# Altium schematic sheet Relays.SchDoc
size A4
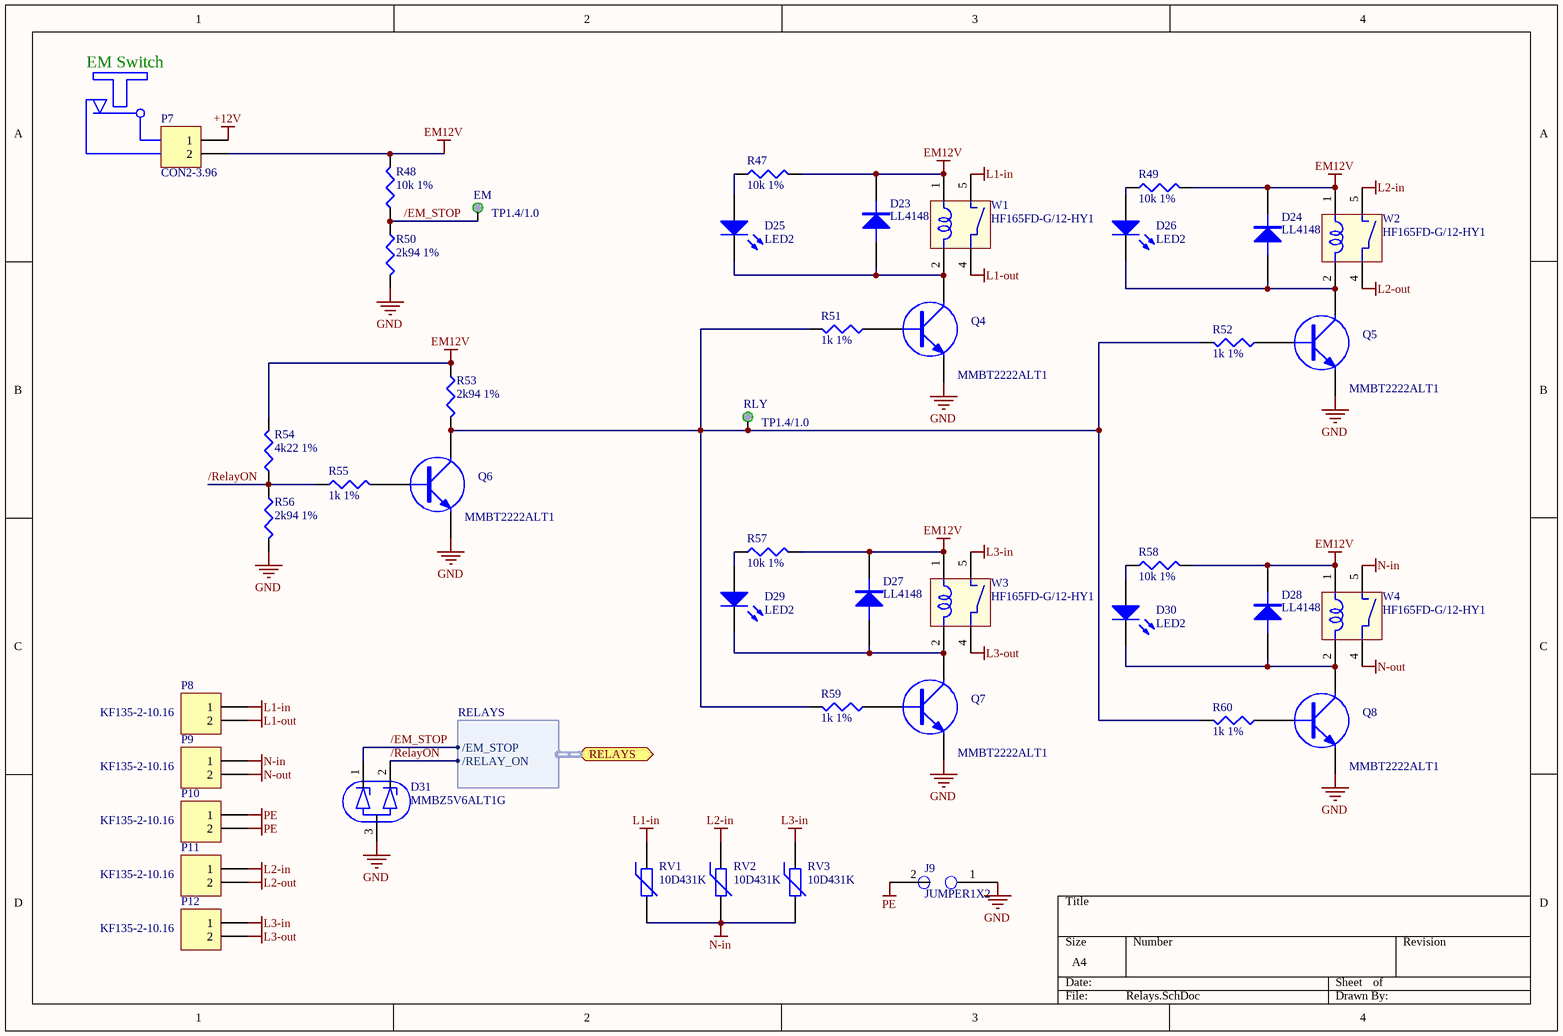
[diagram p0: Relays.SchDoc]

## Parts
D23  LL4148  [MELF-D3513-1405]
D24  LL4148  [MELF-D3513-1405]
D25  LED2  [3.2X1.6X1.1]
D26  LED2  [3.2X1.6X1.1]
D27  LL4148  [MELF-D3513-1405]
D28  LL4148  [MELF-D3513-1405]
D29  LED2  [3.2X1.6X1.1]
D30  LED2  [3.2X1.6X1.1]
D31  MMBZ5V6ALT1G  [SOT23-3N]
EM  TP1.4/1.0  [TP1.4/1.0]  (no BOM)
J9  JUMPER1X2  [JP-SOLDER-H1X2-3X2]  (no BOM)
P7  CON2-3.96  [CON2/3.96mm]
P8  KF135-2-10.16  [KF135-2-10.16]
P9  KF135-2-10.16  [KF135-2-10.16]
P10  KF135-2-10.16  [KF135-2-10.16]
P11  KF135-2-10.16  [KF135-2-10.16]
P12  KF135-2-10.16  [KF135-2-10.16]
Q4  MMBT2222ALT1  [SOT23-3N]
Q5  MMBT2222ALT1  [SOT23-3N]
Q6  MMBT2222ALT1  [SOT23-3N]
Q7  MMBT2222ALT1  [SOT23-3N]
Q8  MMBT2222ALT1  [SOT23-3N]
R47  10k 1%  [RESC2012N]
R48  10k 1%  [RESC2012N]
R49  10k 1%  [RESC2012N]
R50  2k94 1%  [RESC2012N]
R51  1k 1%  [RESC2012N]
R52  1k 1%  [RESC2012N]
R53  2k94 1%  [RESC2012N]
R54  4k22 1%  [RESC2012N]
R55  1k 1%  [RESC2012N]
R56  2k94 1%  [RESC2012N]
R57  10k 1%  [RESC2012N]
R58  10k 1%  [RESC2012N]
R59  1k 1%  [RESC2012N]
R60  1k 1%  [RESC2012N]
RLY  TP1.4/1.0  [TP1.4/1.0]  (no BOM)
RV1  10D431K  [10D431K]
RV2  10D431K  [10D431K]
RV3  10D431K  [10D431K]
W1  HF165FD-G/12-HY1  [HF165FD-G/12-HY1]
W2  HF165FD-G/12-HY1  [HF165FD-G/12-HY1]
W3  HF165FD-G/12-HY1  [HF165FD-G/12-HY1]
W4  HF165FD-G/12-HY1  [HF165FD-G/12-HY1]

## Ports
RELAYS (harness RELAYS)

## Harnesses
RELAYS: /EM_STOP, /RELAY_ON

## Nets
+12V: P7.1
EM12V: D23.2(K) D24.2(K) D27.2(K) D28.2(K) P7.2 R47.2 R48.2 R49.2 R53.1 R54.2 R57.2 R58.2 W1.1 W2.1 W3.1 W4.1
GND: D31.3 J9.1 Q4.2(E) Q5.2(E) Q6.2(E) Q7.2(E) Q8.2(E) R50.2 R56.2
L1-in: P8.1 RV1.1 W1.5
L1-out: P8.2 W1.4
L2-in: P11.1 RV2.1 W2.5
L2-out: P11.2 W2.4
L3-in: P12.1 RV3.1 W3.5
L3-out: P12.2 W3.4
N-in: P9.1 RV1.2 RV2.2 RV3.2 W4.5
N-out: P9.2 W4.4
PE: J9.2 P10.1 P10.2
/EM_STOP: D31.1 EM.1 R48.1 R50.1 ; port RELAYS./EM_STOP
/RelayON: D31.2 R54.1 R55.1 R56.1 ; port RELAYS./RELAY_ON
NetD23_1: D23.1(A) D25.2(K) Q4.3(C) W1.2
NetD24_1: D24.1(A) D26.2(K) Q5.3(C) W2.2
NetD25_1: D25.1(A) R47.1
NetD26_1: D26.1(A) R49.1
NetD27_1: D27.1(A) D29.2(K) Q7.3(C) W3.2
NetD28_1: D28.1(A) D30.2(K) Q8.3(C) W4.2
NetD29_1: D29.1(A) R57.1
NetD30_1: D30.1(A) R58.1
NetQ4_1: Q4.1(B) R51.1
NetQ5_1: Q5.1(B) R52.1
NetQ6_1: Q6.1(B) R55.2
NetQ6_3: Q6.3(C) R51.2 R52.2 R53.2 R59.2 R60.2 RLY.1
NetQ7_1: Q7.1(B) R59.1
NetQ8_1: Q8.1(B) R60.1

## Notes on the sheet
- EM Switch

## Library data of the parts
D23 D24 D27 D28 = DIODE
D25 D26 D29 D30 = LED2: Typical RED, GREEN, YELLOW, AMBER GaAs LED; Published: 8-Jun-2000; LatestRevisionDate: 17-Jul-2002; LatestRevisionNote: Re-released for DXP Platform.; PackageDocument: Feb-2002; PackageReference: 3.2X1.6X1.1; Publisher: Altium Limited
D31 = PESD3V3S2UT: ESD protection diode 3.3V; Manufacturer: NXP; Price: 0.25
P7 = Header 2: Header, 2-Pin; LatestRevisionDate: 17-Jul-2002; LatestRevisionNote: Re-released for DXP Platform.; Publisher: Altium Limited
P8-P12 = Header 2: LatestRevisionDate: 17-Jul-2002; LatestRevisionNote: Re-released for DXP Platform.; Publisher: Altium Limited
Q4-Q8 = NPN: NPN transistor; Price: 0.25
R47-R60 = Res3: Resistor
RV1-RV3 = Res Varistor: Varistor (Voltage-Sensitive Resistor); Published: 24-Mar-1999; LatestRevisionDate: 29-May-2009; LatestRevisionNote: IPC-7351 Footprint Added.; PackageVersion: Mar-2003; PackageReference: 6-0805; Publisher: Altium Limited; PackageDescription: Chip Resistor 0805 Case Size; Code_IPC: RESC2012
W1-W4 = HF165FD-G/12-HY1: Hongfa power relay 40A